# Altium schematic sheet Sheet1_Cover.SchDoc: Cover
size A4; DrawnBy: D.N.Nhuan; Revision: NT-1.1; SheetNumber: 1; SheetTotal: 5
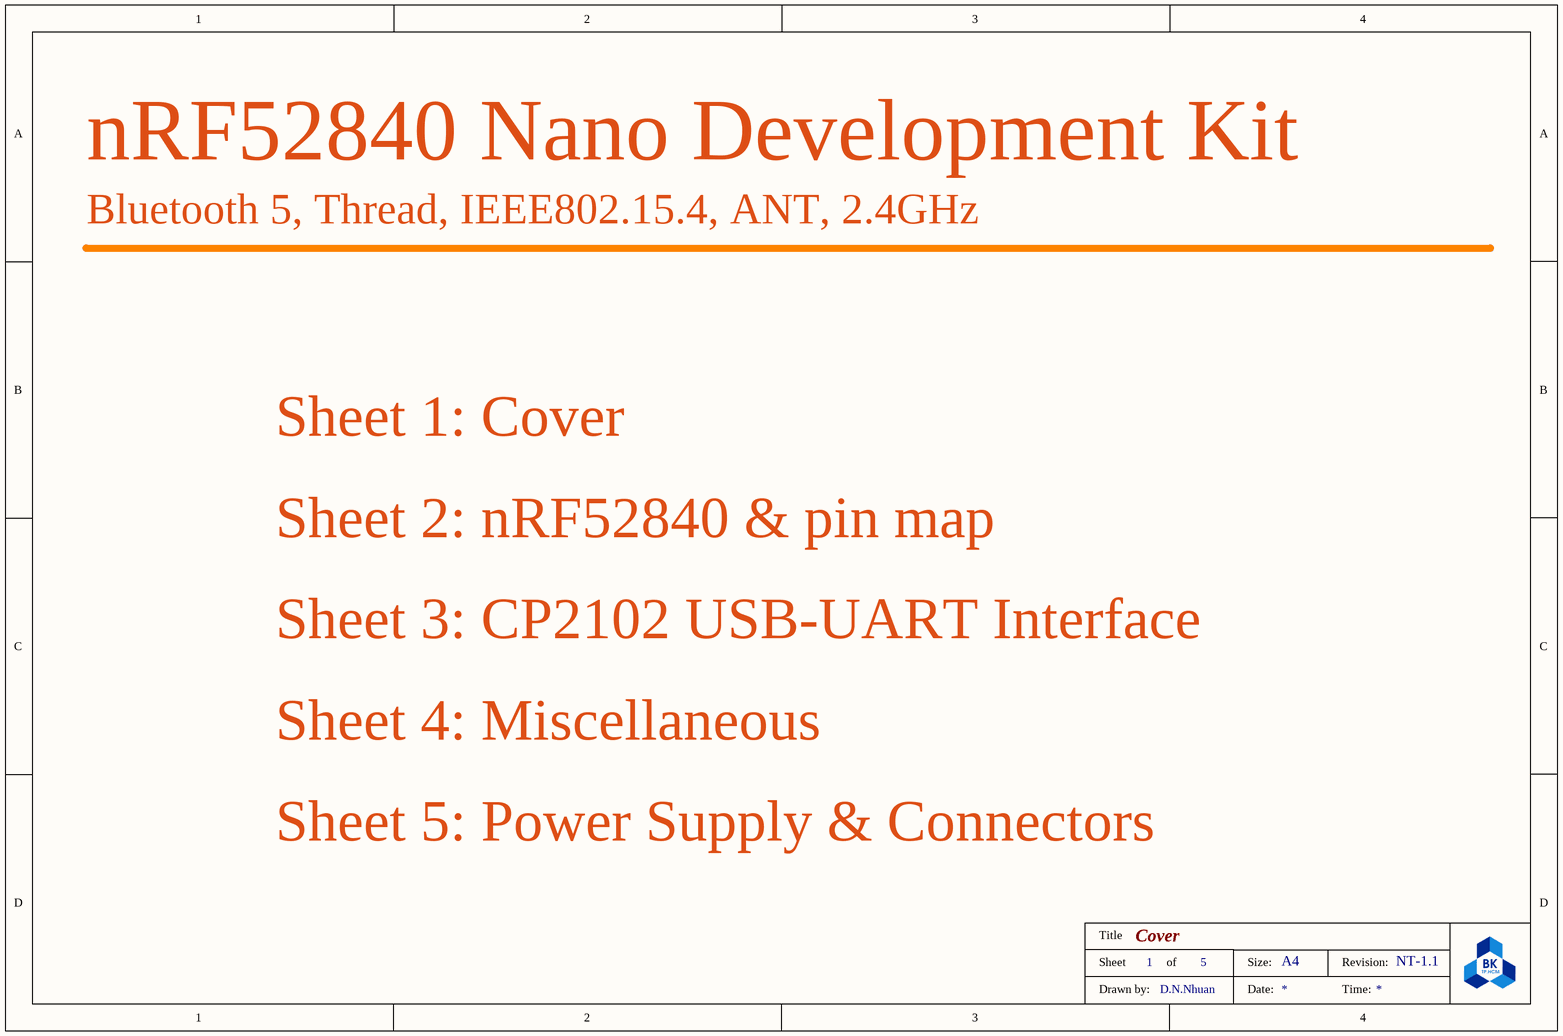
[diagram p0: Sheet1_Cover.SchDoc]

## Notes on the sheet
- nRF52840 Nano Development Kit
- Bluetooth 5, Thread, IEEE802.15.4, ANT, 2.4GHz
- Sheet 1: Cover
- Sheet 2: nRF52840 & pin map
- Sheet 3: CP2102 USB-UART Interface
- Sheet 4: Miscellaneous
- Sheet 5: Power Supply & Connectors
- Title
- Sheet
- of
- Size:
- A4
- Revision:
- Drawn by:
- Date:
- Time: